# Altium schematic sheet Peak Detector.schdoc: Peak Detector
size A4; Organization: Altium Limited; Address1: L3, 12a Rodborough Rd; Address2: Frenchs Forest; Address3: NSW; Address4: Australia 2086; DocumentNumber: 1; SheetNumber: 1; SheetTotal: 1
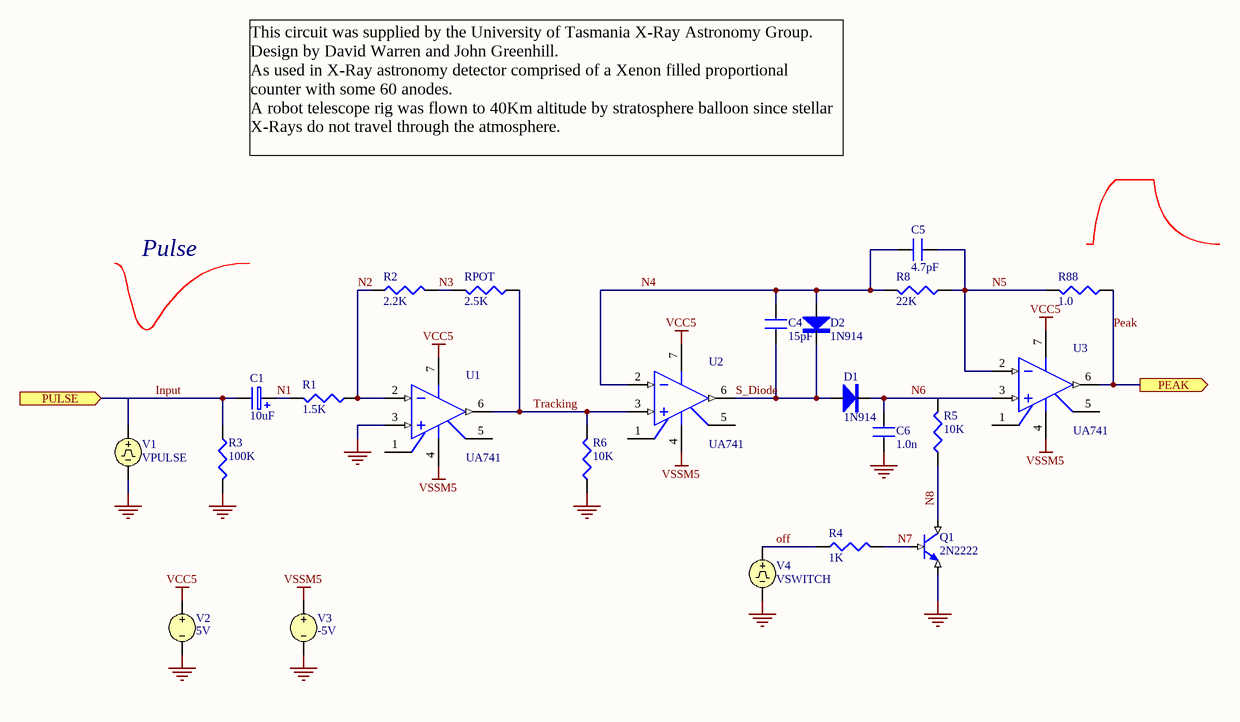
[diagram p0: Peak Detector.schdoc]

## Parts
C1  10uF
C4  15pF
C5  4.7pF
C6  1.0n
D1  1N914
D2  1N914
Q1  2N2222
R1  1.5K
R2  2.2K
R3  100K
R4  1K
R5  10K
R6  10K
R8  22K
R88  1.0
RPOT  2.5K
U1  UA741
U2  UA741
U3  UA741
V1  VPULSE
V2  5V
V3  -5V
V4  VSWITCH

## Ports
PEAK (out), PULSE (in)

## Nets
GND: C6.1 Q1.3(E) R3.1(TOP) R6.2(BOT) U1.3(+IN) V1.2 V2.2 V3.2 V4.2
VCC5: U1.7(V+) U2.7(V+) U3.7(V+) V2.1
VSSM5: U1.4(V-) U2.4(V-) U3.4(V-) V3.1
Input: C1.2 R3.2(BOT) V1.1 ; port PULSE
N1: C1.1 R1.1(TOP)
N2: R1.2(BOT) R2.2(BOT) U1.2(-IN)
N3: R2.1(TOP) RPOT.1(TOP)
N4: C4.1 C5.1 D2.1(A) R8.1(TOP) U2.2(-IN)
N5: C5.2 R8.2(BOT) R88.1(TOP) U3.2(-IN)
N6: C6.2 D1.2(K) R5.1(TOP) U3.3(+IN)
N7: Q1.2(B) R4.1(TOP)
N8: Q1.1(C) R5.2(BOT)
off: R4.2(BOT) V4.1
Peak: R88.2(BOT) U3.6(OUT) ; port PEAK
S_Diode: C4.2 D1.1(A) D2.2(K) U2.6(OUT)
Tracking: R6.1(TOP) RPOT.2(BOT) U1.6(OUT) U2.3(+IN)

Not connected (* = marked no-connect by the designer): U1 1(OFFSET_NULL_1) 5(OFFSET_NULL_2); U2 1(OFFSET_NULL_1) 5(OFFSET_NULL_2); U3 1(OFFSET_NULL_1) 5(OFFSET_NULL_2)

## Notes on the sheet
- This circuit was supplied by the University of Tasmania X-Ray Astronomy Group.
  Design by David Warren and John Greenhill.
  As used in X-Ray astronomy detector comprised of a Xenon filled proportional counter with some 60 anodes.
  A robot telescope rig was flown to 40Km altitude by stratosphere balloon since stellar X-Rays do not travel through the atmosphere.
- Pulse
- Title
- Size:
- Date:
- A4
- Number:
- Time:
- Revision:
- Sheet
- of
- File:

## Library data of the parts
C1 = CAP3: Capacitor; Value: 10uF
C4-C6 = CAP: Capacitor
  C4: Value: 15pF
  C5: Value: 4.7pF
  C6: Value: 1.0n
D1 D2 = 1N914: Diode
Q1 = 2N2222: NPN BJT
R1-R6 R8 R88 RPOT = RES: Resistor
  R1: Value: 1.5K
  R2: Value: 2.2K
  R3: Value: 100K
  R4: Value: 1K
  R5 R6: Value: 10K
  R8: Value: 22K
  R88: Value: 1.0
  RPOT: Value: 2.5K
U1-U3 = UA741: General-Purpose Operational Amplifier
V1 V4 = VPULSE: Pulse Voltage Source
V2 V3 = VSRC: Voltage Source
  V2: Value: 5V
  V3: Value: -5V